# Altium project DRV3.PrjPcb
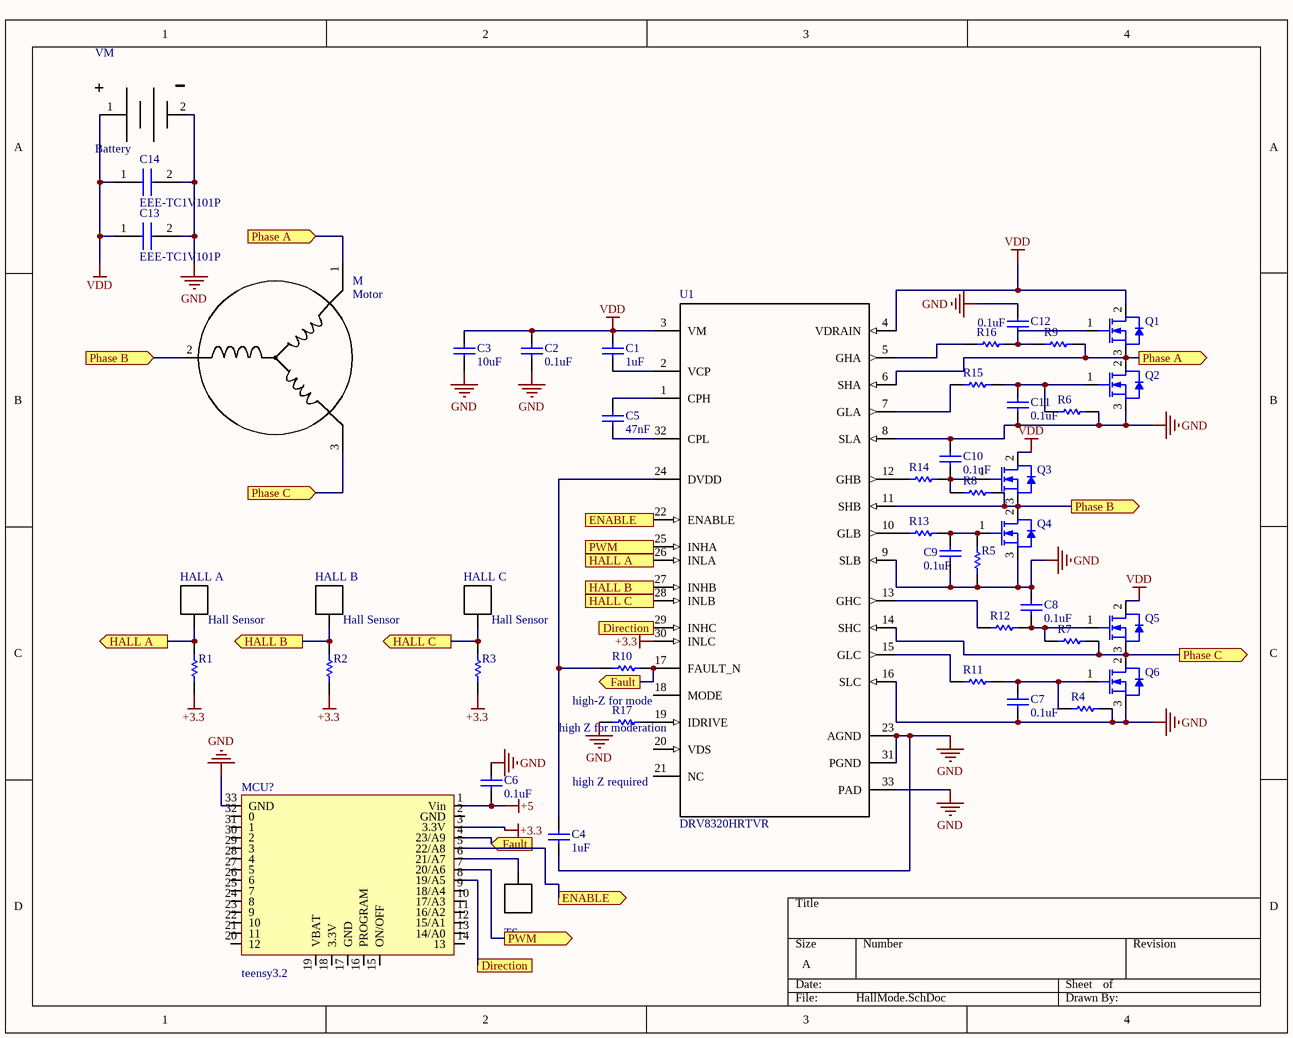
[diagram p0: HallMode.SchDoc]
1 sheet, 45 parts. Net scope: flat (ports and power ports of the same name join across sheets).
Board file: HallMode.PcbDoc

## Sheet HallMode.SchDoc
size A

### Parts
C1  1uF  [CAPC2013X135X45ML10T25]
C2  0.1uF  [CAPC2013X135X45ML10T25]
C3  10uF  [CAPC2013X135X50LL10T20]
C4  1uF  [CAPC2013X135X45ML10T25]
C5  47nF  [CAPC2013X135X45ML10T25]
C6  0.1uF  [CAPC2013X135X45ML10T25]
C7  0.1uF  [CAPC2013X135X45ML10T25]
C8  0.1uF  [CAPC2013X135X45ML10T25]
C9  0.1uF  [CAPC2013X135X45ML10T25]
C10  0.1uF  [CAPC2013X135X45ML10T25]
C11  0.1uF  [CAPC2013X135X45ML10T25]
C12  0.1uF  [CAPC2013X135X45ML10T25]
C13  EEE-TC1V101P  [CAPAE830X1050N]
C14  EEE-TC1V101P  [CAPAE830X1050N]
HALL_A  Hall Sensor  [A single pin]
HALL_B  Hall Sensor  [A single pin]
HALL_C  Hall Sensor  [A single pin]
M  Motor  [Motor]
MCU?  teensy3.2  [teensy3.2]
Q1  INFINEON  [MOSFET-2]  (value not drawn)
Q2  INFINEON  [MOSFET-2]  (value not drawn)
Q3  INFINEON  [MOSFET-2]  (value not drawn)
Q4  INFINEON  [MOSFET-2]  (value not drawn)
Q5  INFINEON  [MOSFET-2]  (value not drawn)
Q6  INFINEON  [MOSFET-2]  (value not drawn)
R1  CRCW08050000Z0EA  [RESC2013X50X30LL20T20]  (value not drawn)
R2  CRCW08050000Z0EA  [RESC2013X50X30LL20T20]  (value not drawn)
R3  CRCW08050000Z0EA  [RESC2013X50X30LL20T20]  (value not drawn)
R4  CRCW08050000Z0EA  [RESC2013X50X30LL20T20]  (value not drawn)
R5  CRCW08050000Z0EA  [RESC2013X50X30LL20T20]  (value not drawn)
R6  CRCW08050000Z0EA  [RESC2013X50X30LL20T20]  (value not drawn)
R7  CRCW08050000Z0EA  [RESC2013X50X30LL20T20]  (value not drawn)
R8  CRCW08050000Z0EA  [RESC2013X50X30LL20T20]  (value not drawn)
R9  CRCW08050000Z0EA  [RESC2013X50X30LL20T20]  (value not drawn)
R10  CRCW08050000Z0EA  [RESC2013X50X30LL20T20]  (value not drawn)
R11  CRCW08050000Z0EA  [RESC2013X50X30LL20T20]  (value not drawn)
R12  CRCW08050000Z0EA  [RESC2013X50X30LL20T20]  (value not drawn)
R13  CRCW08050000Z0EA  [RESC2013X50X30LL20T20]  (value not drawn)
R14  CRCW08050000Z0EA  [RESC2013X50X30LL20T20]  (value not drawn)
R15  CRCW08050000Z0EA  [RESC2013X50X30LL20T20]  (value not drawn)
R16  CRCW08050000Z0EA  [RESC2013X50X30LL20T20]  (value not drawn)
R17  CRCW08050000Z0EA  [RESC2013X50X30LL20T20]  (value not drawn)
TS  (no value)  [A single pin]
U1  DRV8320HRTVR  [RTV0032E]
VM  Battery  [*AMASS_XT60-M]

### Ports
Direction, ENABLE (in), ENABLE (out), Fault (in), Fault (out), HALL A (in), HALL A (out), HALL B (in), HALL B (out), HALL C (in), HALL C (out), Phase A (in), Phase A (out), Phase B (in), Phase B (out), Phase C (in), Phase C (out), PWM (in), PWM (out)

### Nets
+3.3: MCU?.3(3.3V) R1.1 R2.1 R3.1 U1.30(INLC)
+5: C6.1 MCU?.1(Vin)
GND: C2.1 C3.1 C4.1 C6.2 C7.1 C8.2 C9.1 C10.2 C11.1 C12.2 C13.2(-) C14.2(-) MCU?.33(GND) Q2.3(S) Q4.3(S) Q6.3(S) R4.1 R5.2 R6.1 R17.2 U1.8(SLA) U1.9(SLB) U1.16(SLC) U1.23(AGND) U1.31(PGND) U1.33(PAD) VM.2
VDD: C1.2 C2.2 C3.2 C13.1(+) C14.1(+) Q1.2(D) Q3.2(D) Q5.2(D) U1.3(VM) U1.4(VDRAIN) VM.1
NetC1_1: C1.1 U1.2(VCP)
NetC4_2: C4.2 R10.2 U1.24(DVDD)
NetC5_1: C5.1 U1.32(CPL)
NetC5_2: C5.2 U1.1(CPH)
NetC7_2: C7.2 Q6.1(G) R4.2 R11.1
NetC8_1: C8.1 Q5.1(G) R7.2 R12.1
NetC9_2: C9.2 Q4.1(G) R5.1 R13.1
NetC10_1: C10.1 Q3.1(G) R8.2 R14.1
NetC11_2: C11.2 Q2.1(G) R6.2 R15.1
NetC12_1: C12.1 Q1.1(G) R9.2 R16.1
NetHALL_A_0: HALL_A.0 R1.2 U1.26(INLA) ; port HALL A
NetHALL_B_0: HALL_B.0 R2.2 U1.27(INHB) ; port HALL B
NetHALL_C_0: HALL_C.0 R3.2 U1.28(INLB) ; port HALL C
NetM_1: M.1(A) Q1.3(S) Q2.2(D) R9.1 U1.6(SHA) ; port Phase A
NetM_2: M.2(B) Q3.3(S) Q4.2(D) R8.1 U1.11(SHB) ; port Phase B
NetM_3: M.3(C) Q5.3(S) Q6.2(D) R7.1 U1.14(SHC) ; port Phase C
NetMCU?_4: MCU?.4(23/A9) R10.1 U1.17(FAULT_N) ; port Fault
NetMCU?_5: MCU?.5(22/A8) U1.22(ENABLE) ; port ENABLE
NetMCU?_6: MCU?.6(21/A7) TS.0
NetMCU?_7: MCU?.7(20/A6) U1.25(INHA) ; port PWM
NetMCU?_8: MCU?.8(19/A5) U1.29(INHC) ; port Direction
NetR11_2: R11.2 U1.15(GLC)
NetR12_2: R12.2 U1.13(GHC)
NetR13_2: R13.2 U1.10(GLB)
NetR14_2: R14.2 U1.12(GHB)
NetR15_2: R15.2 U1.7(GLA)
NetR16_2: R16.2 U1.5(GHA)
NetR17_1: R17.1 U1.19(IDRIVE)

Not connected (* = marked no-connect by the designer): MCU? 2(GND) 9(18/A4) 10(17/A3) 11(16/A2) 12(15/A1) 13(14/A0) 14(13) 15(ON/OFF) 16(PROGRAM) 17(GND) 18(3.3V) 19(VBAT) 20(12) 21(11) 22(10) 23(9) 24(8) 25(7) 26(6) 27(5) 28(4) 29(3) 30(2) 31(1) 32(0); U1 18(MODE) 20(VDS) 21(NC)

### Notes on the sheet
- high-Z for mode
- high Z for moderation
- (near U1) high Z required
- (in symbol Battery) -; +

### Library data of the parts
C1 C4 C5 = CMP-2000-04946-1: Multilayer Ceramic Capacitor, 1 uF, +/- 10%, 16 V, -55 to 125 degC, 0805 (2012 Metric), RoHS, Tape and Reel; Manufacturer: Murata; Dielectric: X7R; Capacitance: 1µF; Rated Voltage: 16V; Package Description: 2-Pin Surface Mount Device, Body 2 x 1.25 mm; Datasheet Version: Mar-08; Package Reference: 805; Datasheet URL: https://datasheet.ciiva.com/34302/1858922-34302874.pdf; Case Size/Dimension: 0805; Tolerance (%): ±10%; Manufacturer URL: http://www.murata.com/
C2 C6-C12 = CMP-2100-03644-1: Chip Capacitor, 0.1 uF, +/- 10%, 50 V, -55 to 125 degC, 0805 (2012 Metric), RoHS, Tape and Reel; Manufacturer: Murata; Voltage: 50V; Capacitance: 100nF; Insulation Resistance: 10GR; Dielectric Material: Ceramic; Dielectric: X7R; Package Description: 2-Pin Surface Mount Device, Body 2 x 1.25 mm; Manufacturer URL: http://www.murata.com/; Case Code (Imperial): 0805; Datasheet URL: http://psearch.en.murata.com/capacitor/product/GRM21BR71H104KA01%23.pdf; Termination: SMD/SMT; Lead Free: LeadFree; Package Quantity: 1; Mount: SurfaceMount; REACH SVHC: Unknown; Thickness: 0.053inch; Height: 1.25mm; Case/Package: 0805; Voltage Rating: 50V; Width: 0.049inch; Case Code (Metric): 2012; Material: Ceramic; Min Operating Temperature: -55degC; RoHSCompliant: true; Datasheet Version: 42675.0; Voltage Rating (DC): 50V; Tolerance: 10%; Package Reference: 0805; Depth: 1.25mm; Length: 2mm; Max Operating Temperature: 125degC; Packaging: TapeandReel; Number of Pins: 2; Radiation Hardening: No
C3 = CMP-2007-03453-1: Manufacturer: Murata; Part Number: GRM21BR61C106KE15L
C13 C14 = EEE-TC1V101P: Capacitor; Manufacturer_Name: Panasonic; Datasheet Link: https://www.mouser.in/datasheet/2/315/ABA0000C678-951953.pdf; Height: 10.5mm; Manufacturer_Part_Number: EEE-TC1V101P; Arrow Part Number: EEE-TC1V101P; Arrow Price/Stock: https://www.arrow.com/en/products/eee-tc1v101p/panasonic; Mouser Part Number: 667-EEE-TC1V101P; Mouser Price/Stock: https://www.mouser.com/Search/Refine.aspx?Keyword=667-EEE-TC1V101P
R1-R17 = CMP-2001-04896-1: Manufacturer: Vishay Dale; Part Number: CRCW08050000Z0EA
TS = Hall Sensor
U1 = DRV8320HRTVR: No Description Available; Manufacturer: Texas Instruments; PartNumber: DRV8320HRTVR; RefDes: RefDes; Type: DEV; Value: Value; Copyright: Copyright (C) 2018 Accelerated Designs. All rights reserved